# Altium schematic sheet MPU_2.SchDoc
size A3; SheetNumber: 6; SheetTotal: 9
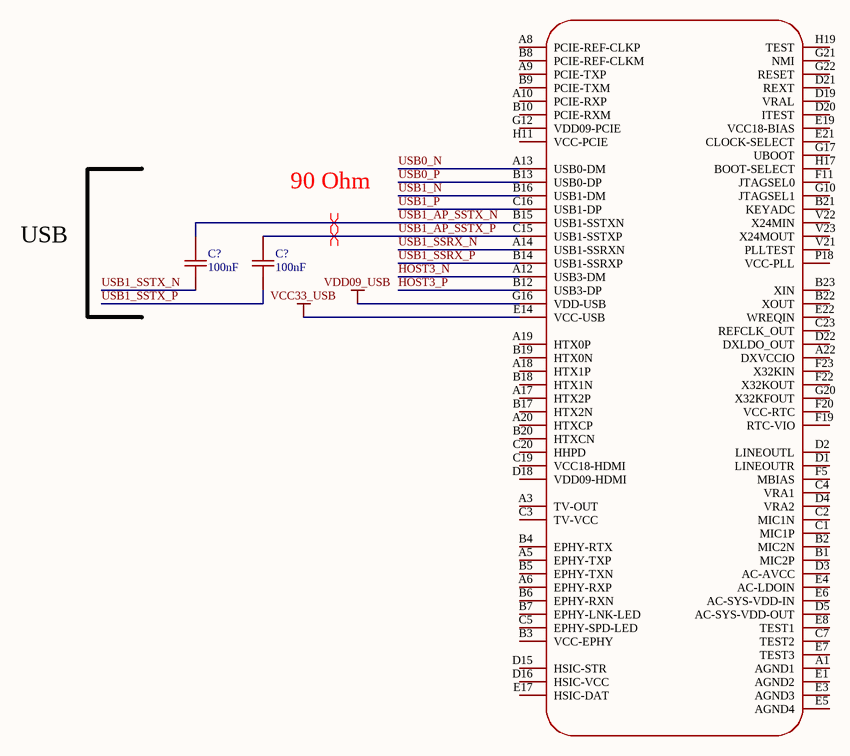
[diagram p0: MPU_2.SchDoc]

## Parts
(Parts that share a designator on the sheet are numbered #1, #2 ... from top to bottom, then left to right.)
C?#1  100nF  [C0402]
C?#2  100nF  [C0402]
U??  Allwinner_H6  [BGA451_ALLWINNER_H6]  (value not drawn)  (part C of 4)

## Nets
VCC33_USB: U??.E14(VCC-USB)
VDD09_USB: U??.G16(VDD-USB)
HOST3_N: U??.A12(USB3-DM)
HOST3_P: U??.B12(USB3-DP)
USB0_N: U??.A13(USB0-DM)
USB0_P: U??.B13(USB0-DP)
USB1_AP_SSTX_N: C?#1.2 U??.B15(USB1-SSTXN)
USB1_AP_SSTX_P: C?#2.2 U??.C15(USB1-SSTXP)
USB1_N: U??.B16(USB1-DM)
USB1_P: U??.C16(USB1-DP)
USB1_SSRX_N: U??.A14(USB1-SSRXN)
USB1_SSRX_P: U??.B14(USB1-SSRXP)
USB1_SSTX_N: C?#1.1
USB1_SSTX_P: C?#2.1

Not connected (* = marked no-connect by the designer): U?? A1(AGND1) A3(TV-OUT) A5(EPHY-TXP) A6(EPHY-RXP) A8(PCIE-REF-CLKP) A9(PCIE-TXP) A10(PCIE-RXP) A17(HTX2P) A18(HTX1P) A19(HTX0P) A20(HTXCP) A22(DXVCCIO) B1(MIC2P) B2(MIC2N) B3(VCC-EPHY) B4(EPHY-RTX) B5(EPHY-TXN) B6(EPHY-RXN) B7(EPHY-LNK-LED) B8(PCIE-REF-CLKM) B9(PCIE-TXM) B10(PCIE-RXM) B17(HTX2N) B18(HTX1N) B19(HTX0N) B20(HTXCN) B21(KEYADC) B22(XOUT) B23(XIN) C1(MIC1P) C2(MIC1N) C3(TV-VCC) C4(VRA1) C5(EPHY-SPD-LED) C7(TEST2) C19(VCC18-HDMI) C20(HHPD) C23(REFCLK_OUT) D1(LINEOUTR) D2(LINEOUTL) D3(AC-AVCC) D4(VRA2) D5(AC-SYS-VDD-OUT) D15(HSIC-STR) D16(HSIC-VCC) D18(VDD09-HDMI) D19(VRAL) D20(ITEST) D21(REXT) D22(DXLDO_OUT) E1(AGND2) E3(AGND3) E4(AC-LDOIN) E5(AGND4) E6(AC-SYS-VDD-IN) E7(TEST3) E8(TEST1) E17(HSIC-DAT) E19(VCC18-BIAS) E21(CLOCK-SELECT) E22(WREQIN) F5(MBIAS) F11(JTAGSEL0) F19(RTC-VIO) F20(VCC-RTC) F22(X32KOUT) F23(X32KIN) G10(JTAGSEL1) G12(VDD09-PCIE) G17(UBOOT) G20(X32KFOUT) G21(NMI) G22(RESET) H11(VCC-PCIE) H17(BOOT-SELECT) H19(TEST) P18(VCC-PLL) V21(PLLTEST) V22(X24MIN) V23(X24MOUT)

## Layout directives
differential pair: USB1_AP_SSTX_N, USB1_AP_SSTX_P

## Notes on the sheet
- 90 Ohm
- USB

## Library data of the parts
C?#1 C?#2 = 100nF: 50V 100nF X7R ±10% 0402 Ceramic Capacitors ROHS
U?? = Allwinner_H6: Add into BOM: yes; Symbol: Allwinner_H6; Device: Allwinner_H6; Convert to PCB: yes